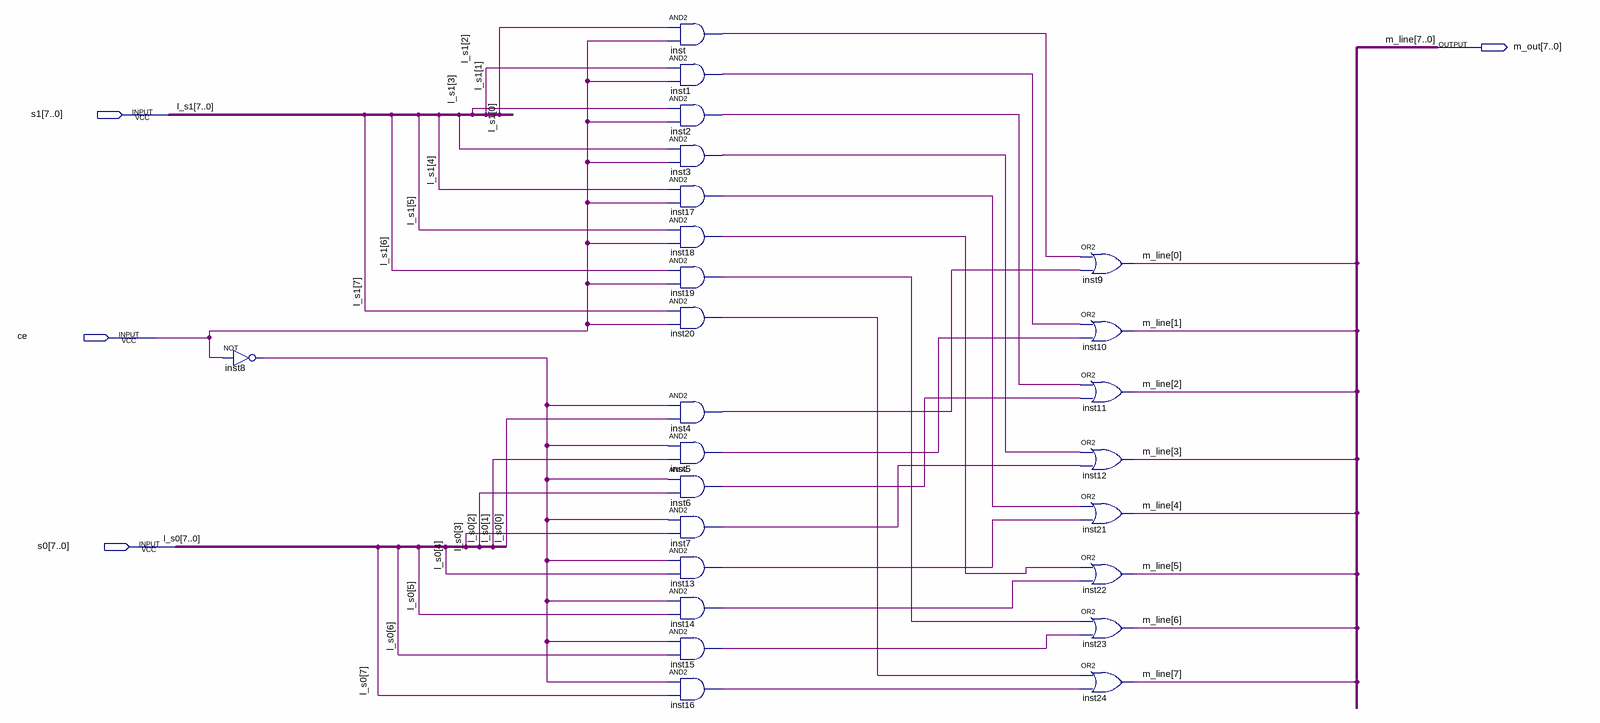
[diagram p0: schematic sheet]
// Quartus schematic mx_8bit_2x1.bdf as structural Verilog: 25 symbols, 4 pins
module mx_8bit_2x1 (
  input  [7:0] s1,
  input  ce,
  input  [7:0] s0,
  output [7:0] m_out
);

  wire inst1_out, inst2_out, inst3_out, inst4_out, inst5_out, inst6_out, inst7_out, inst8_out, inst13_out,
       inst14_out, inst15_out, inst16_out, inst17_out, inst18_out, inst19_out, inst20_out, inst_out;

  not inst8 (inst8_out, ce);
  and inst (inst_out, s1[0], ce);
  and inst1 (inst1_out, s1[1], ce);
  and inst2 (inst2_out, s1[2], ce);
  and inst3 (inst3_out, s1[3], ce);
  and inst17 (inst17_out, s1[4], ce);
  and inst18 (inst18_out, s1[5], ce);
  and inst19 (inst19_out, s1[6], ce);
  and inst20 (inst20_out, s1[7], ce);
  and inst4 (inst4_out, inst8_out, s0[0]);
  and inst5 (inst5_out, inst8_out, s0[1]);
  and inst6 (inst6_out, inst8_out, s0[2]);
  and inst7 (inst7_out, inst8_out, s0[3]);
  and inst13 (inst13_out, inst8_out, s0[4]);
  and inst14 (inst14_out, inst8_out, s0[5]);
  and inst15 (inst15_out, inst8_out, s0[6]);
  and inst16 (inst16_out, inst8_out, s0[7]);
  or inst9 (m_out[0], inst_out, inst4_out);
  or inst10 (m_out[1], inst1_out, inst5_out);
  or inst11 (m_out[2], inst2_out, inst6_out);
  or inst12 (m_out[3], inst3_out, inst7_out);
  or inst21 (m_out[4], inst17_out, inst13_out);
  or inst22 (m_out[5], inst18_out, inst14_out);
  or inst23 (m_out[6], inst19_out, inst15_out);
  or inst24 (m_out[7], inst20_out, inst16_out);

  // Other names for the same wires on the sheet: l_s0[7:0] = s0; l_s1[7:0] = s1; m_line[7:0] = m_out
endmodule
